# EAGLE schematic Schaltplan (EAGLE 9.6.2)
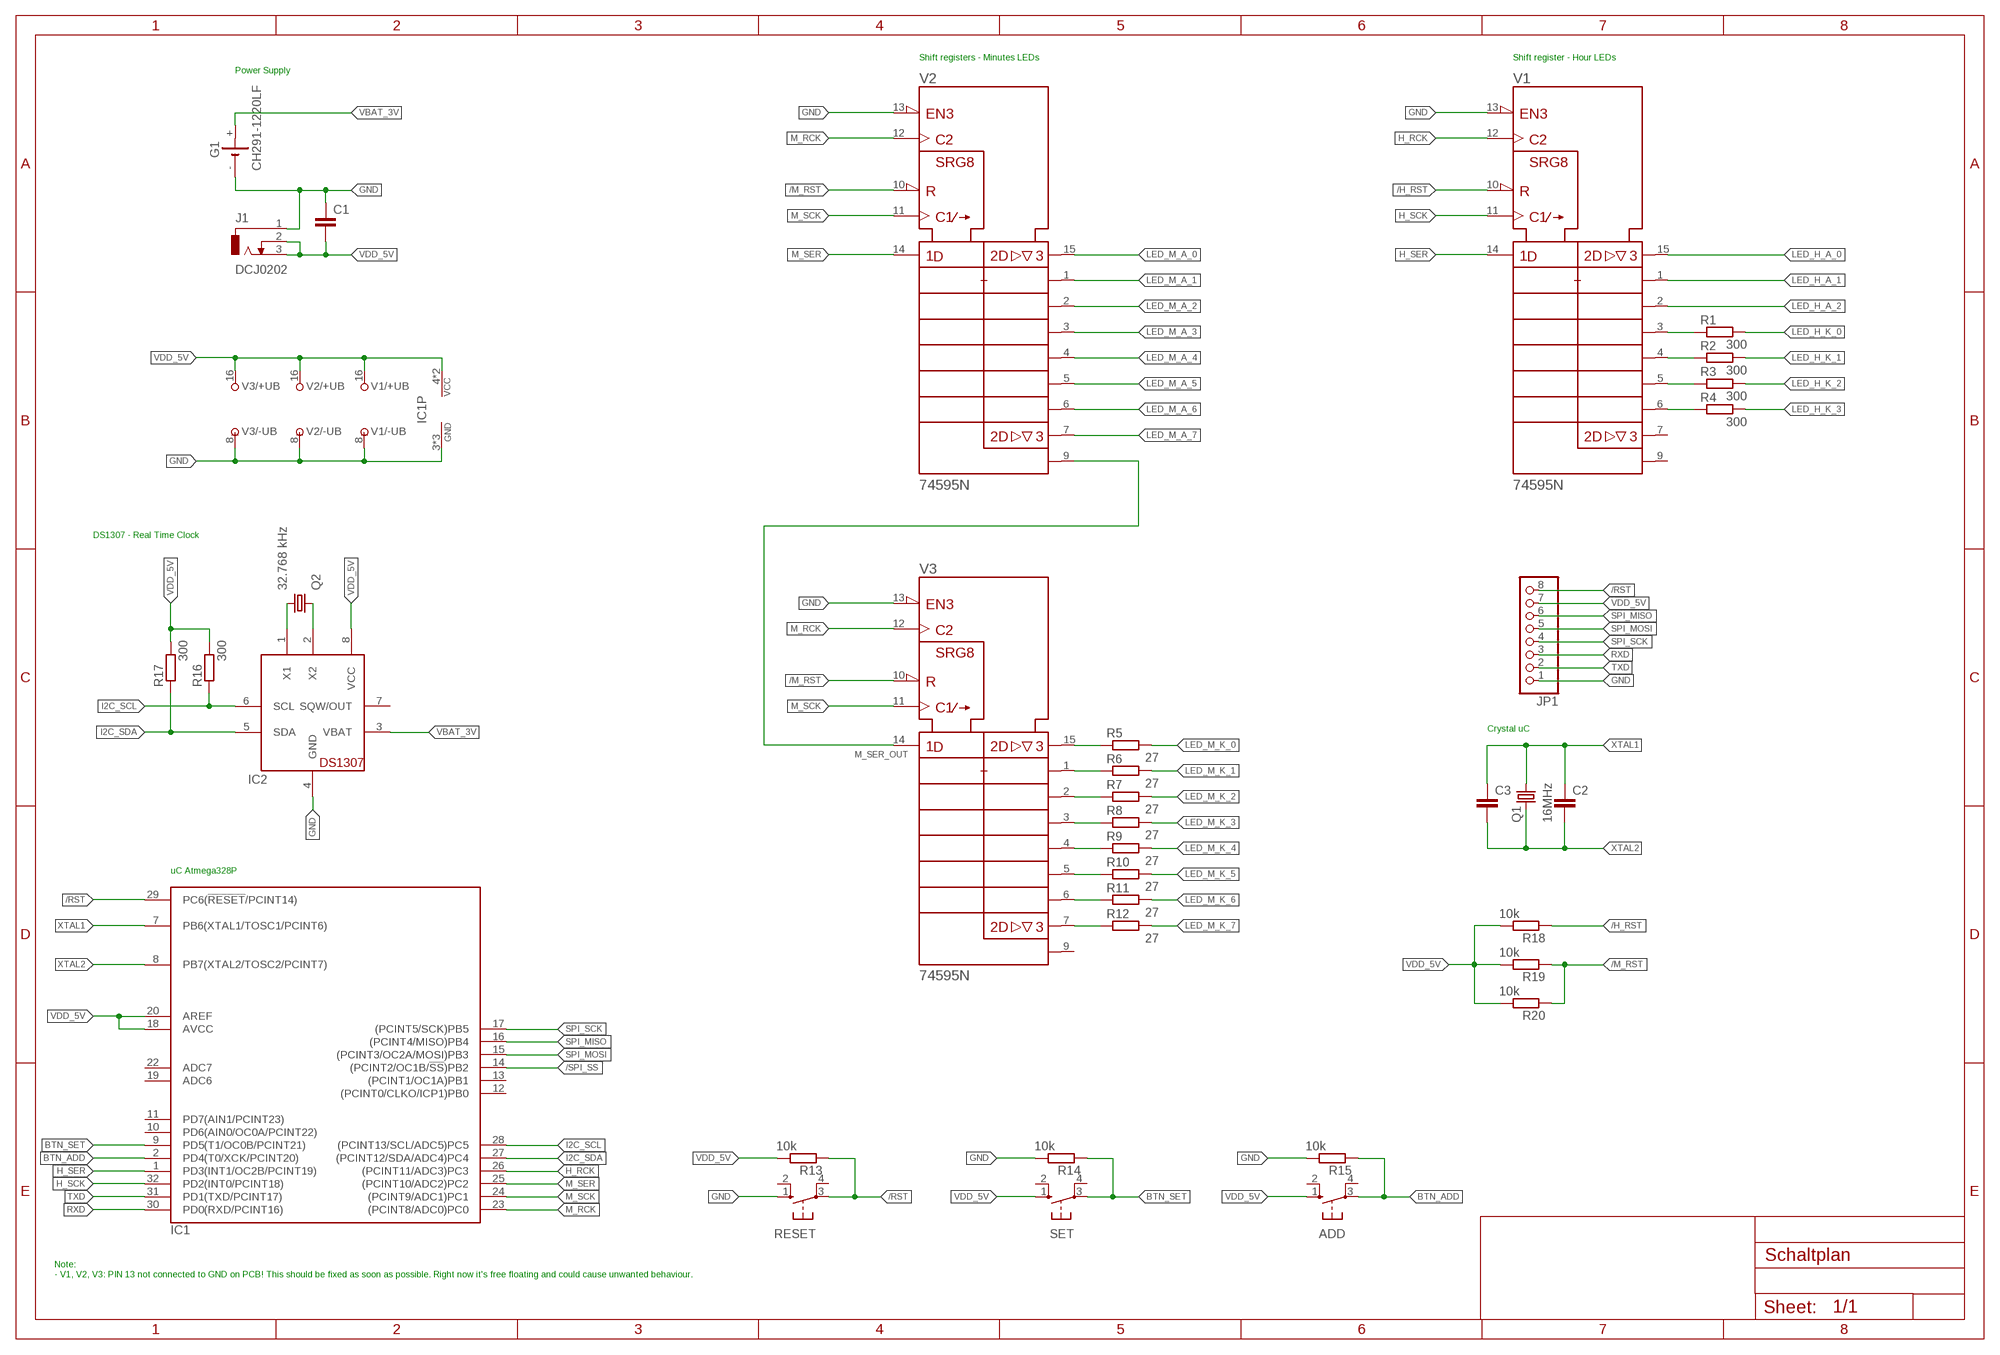
[diagram p0: schematic, sheet 1, part 1 of 2]
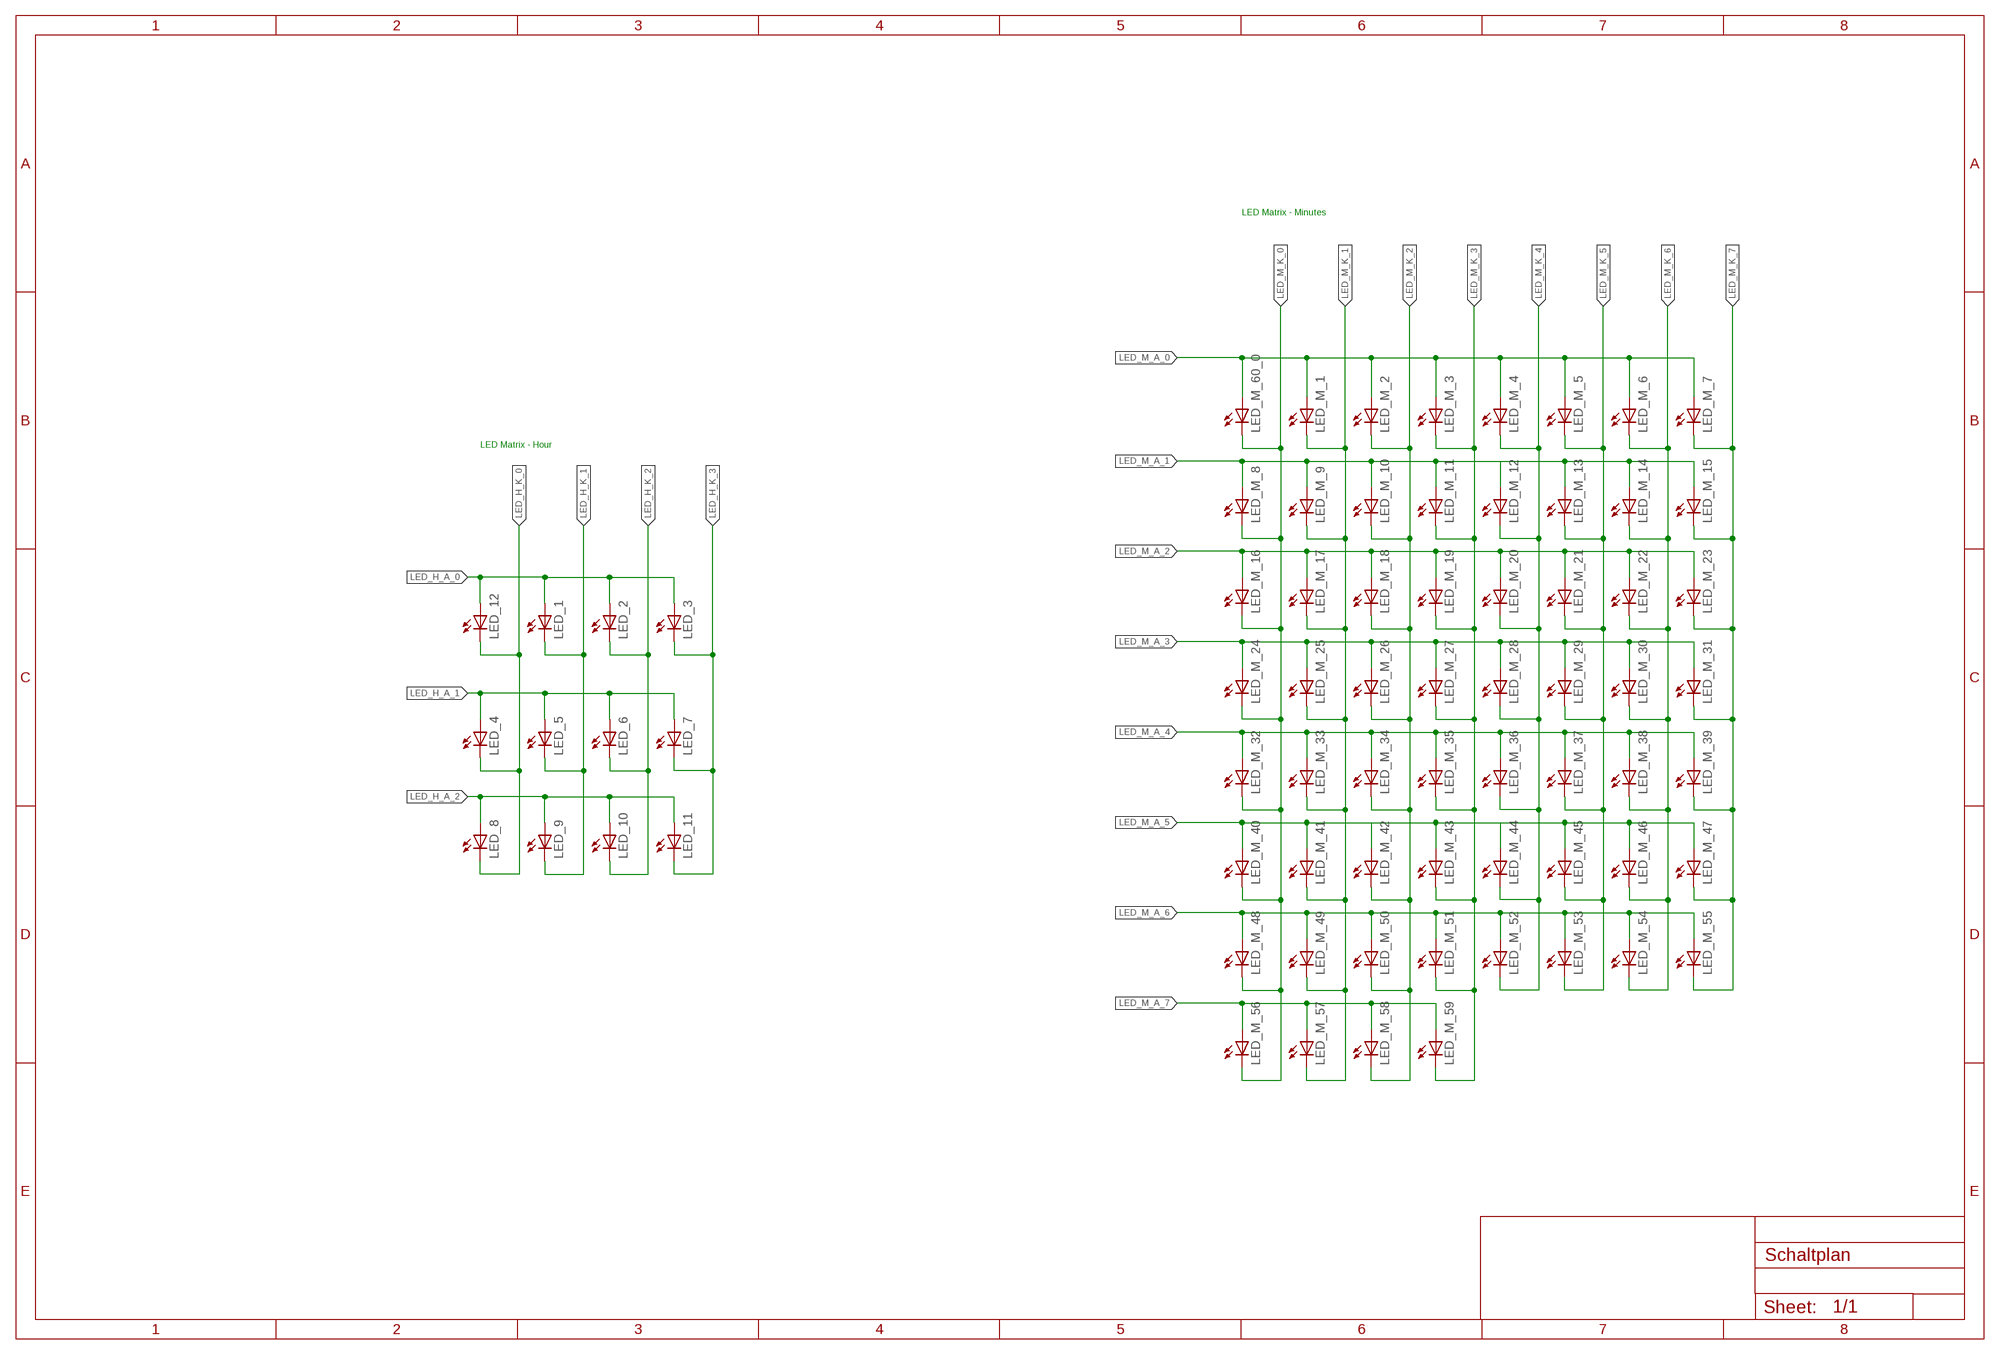
[diagram p1: schematic, sheet 1, part 2 of 2]

## Parts
ADD  10-XX  [B3F-10XX]
C1  C-EUC1206  [C1206]
C2  C-EUC1206  [C1206]
C3  C-EUC1206  [C1206]
G1  CH291-1220LF  [CH291-1220LF]
IC1  ATMEGA328P-AN  [QFP32_7X7_0.80]
IC2  DS1307  [DIL08]
J1  DCJ0202  [DCJ0202]
JP1  PINHD-1X8  [1X08]
LED_1  LED5MM  [LED5MM]
LED_2  LED5MM  [LED5MM]
LED_3  LED5MM  [LED5MM]
LED_4  LED5MM  [LED5MM]
LED_5  LED5MM  [LED5MM]
LED_6  LED5MM  [LED5MM]
LED_7  LED5MM  [LED5MM]
LED_8  LED5MM  [LED5MM]
LED_9  LED5MM  [LED5MM]
LED_10  LED5MM  [LED5MM]
LED_11  LED5MM  [LED5MM]
LED_12  LED5MM  [LED5MM]
LED_M_1  LED5MM  [LED5MM]
LED_M_2  LED5MM  [LED5MM]
LED_M_3  LED5MM  [LED5MM]
LED_M_4  LED5MM  [LED5MM]
LED_M_5  LED5MM  [LED5MM]
LED_M_6  LED5MM  [LED5MM]
LED_M_7  LED5MM  [LED5MM]
LED_M_8  LED5MM  [LED5MM]
LED_M_9  LED5MM  [LED5MM]
LED_M_10  LED5MM  [LED5MM]
LED_M_11  LED5MM  [LED5MM]
LED_M_12  LED5MM  [LED5MM]
LED_M_13  LED5MM  [LED5MM]
LED_M_14  LED5MM  [LED5MM]
LED_M_15  LED5MM  [LED5MM]
LED_M_16  LED5MM  [LED5MM]
LED_M_17  LED5MM  [LED5MM]
LED_M_18  LED5MM  [LED5MM]
LED_M_19  LED5MM  [LED5MM]
LED_M_20  LED5MM  [LED5MM]
LED_M_21  LED5MM  [LED5MM]
LED_M_22  LED5MM  [LED5MM]
LED_M_23  LED5MM  [LED5MM]
LED_M_24  LED5MM  [LED5MM]
LED_M_25  LED5MM  [LED5MM]
LED_M_26  LED5MM  [LED5MM]
LED_M_27  LED5MM  [LED5MM]
LED_M_28  LED5MM  [LED5MM]
LED_M_29  LED5MM  [LED5MM]
LED_M_30  LED5MM  [LED5MM]
LED_M_31  LED5MM  [LED5MM]
LED_M_32  LED5MM  [LED5MM]
LED_M_33  LED5MM  [LED5MM]
LED_M_34  LED5MM  [LED5MM]
LED_M_35  LED5MM  [LED5MM]
LED_M_36  LED5MM  [LED5MM]
LED_M_37  LED5MM  [LED5MM]
LED_M_38  LED5MM  [LED5MM]
LED_M_39  LED5MM  [LED5MM]
LED_M_40  LED5MM  [LED5MM]
LED_M_41  LED5MM  [LED5MM]
LED_M_42  LED5MM  [LED5MM]
LED_M_43  LED5MM  [LED5MM]
LED_M_44  LED5MM  [LED5MM]
LED_M_45  LED5MM  [LED5MM]
LED_M_46  LED5MM  [LED5MM]
LED_M_47  LED5MM  [LED5MM]
LED_M_48  LED5MM  [LED5MM]
LED_M_49  LED5MM  [LED5MM]
LED_M_50  LED5MM  [LED5MM]
LED_M_51  LED5MM  [LED5MM]
LED_M_52  LED5MM  [LED5MM]
LED_M_53  LED5MM  [LED5MM]
LED_M_54  LED5MM  [LED5MM]
LED_M_55  LED5MM  [LED5MM]
LED_M_56  LED5MM  [LED5MM]
LED_M_57  LED5MM  [LED5MM]
LED_M_58  LED5MM  [LED5MM]
LED_M_59  LED5MM  [LED5MM]
LED_M_60_0  LED5MM  [LED5MM]
Q1  16MHz  CRYSTALHC49UP  [HC49UP]
Q2  32.768 kHz  CRYSTALTC26V  [TC26V]
R1  300  R-EU_R5025  [R5025]
R2  300  R-EU_R5025  [R5025]
R3  300  R-EU_R5025  [R5025]
R4  300  R-EU_R5025  [R5025]
R5  27  R-EU_R5025  [R5025]
R6  27  R-EU_R5025  [R5025]
R7  27  R-EU_R5025  [R5025]
R8  27  R-EU_R5025  [R5025]
R9  27  R-EU_R5025  [R5025]
R10  27  R-EU_R5025  [R5025]
R11  27  R-EU_R5025  [R5025]
R12  27  R-EU_R5025  [R5025]
R13  10k  R-EU_R5025  [R5025]
R14  10k  R-EU_R5025  [R5025]
R15  10k  R-EU_R5025  [R5025]
R16  300  R-EU_R5025  [R5025]
R17  300  R-EU_R5025  [R5025]
R18  10k  R-EU_R5025  [R5025]
R19  10k  R-EU_R5025  [R5025]
R20  10k  R-EU_R5025  [R5025]
RESET  10-XX  [B3F-10XX]
SET  10-XX  [B3F-10XX]
V1  74595N  [DIL16]
V2  74595N  [DIL16]
V3  74595N  [DIL16]

## Nets
/H_RST: R18.1 V1.10(!SRCLR)
/M_RST: R19.1 R20.1 V2.10(!SRCLR) V3.10(!SRCLR)
/RST: IC1.29(PC6(!RESET!/PCINT14)) JP1.8 R13.1 RESET.3(P)
/SPI_SS: IC1.14((PCINT2/OC1B/!SS!)PB2)
BTN_ADD: ADD.3(P) IC1.2(PD4(T0/XCK/PCINT20)) R15.1
BTN_SET: IC1.9(PD5(T1/OC0B/PCINT21)) R14.1 SET.3(P)
GND: C1.1 G1.- IC1.3(GND) IC1.5(GND) IC1.21(GND) IC2.4(GND) J1.1 JP1.1 R14.2 R15.2 RESET.1(S) V1.8(-UB) V1.13(!G) V2.8(-UB) V2.13(!G) V3.8(-UB) V3.13(!G)
H_RCK: IC1.26((PCINT11/ADC3)PC3) V1.12(RCK)
H_SCK: IC1.32(PD2(INT0/PCINT18)) V1.11(SRCK)
H_SER: IC1.1(PD3(INT1/OC2B/PCINT19)) V1.14(SER)
I2C_SCL: IC1.28((PCINT13/SCL/ADC5)PC5) IC2.6(SCL) R16.1
I2C_SDA: IC1.27((PCINT12/SDA/ADC4)PC4) IC2.5(SDA) R17.1
LED_H_A_0: LED_1.A LED_2.A LED_3.A LED_12.A V1.15(QA)
LED_H_A_1: LED_4.A LED_5.A LED_6.A LED_7.A V1.1(QB)
LED_H_A_2: LED_8.A LED_9.A LED_10.A LED_11.A V1.2(QC)
LED_H_K_0: LED_4.K(C) LED_8.K(C) LED_12.K(C) R1.2
LED_H_K_1: LED_1.K(C) LED_5.K(C) LED_9.K(C) R2.2
LED_H_K_2: LED_2.K(C) LED_6.K(C) LED_10.K(C) R3.2
LED_H_K_3: LED_3.K(C) LED_7.K(C) LED_11.K(C) R4.2
LED_M_A_0: LED_M_1.A LED_M_2.A LED_M_3.A LED_M_4.A LED_M_5.A LED_M_6.A LED_M_7.A LED_M_60_0.A V2.15(QA)
LED_M_A_1: LED_M_8.A LED_M_9.A LED_M_10.A LED_M_11.A LED_M_12.A LED_M_13.A LED_M_14.A LED_M_15.A V2.1(QB)
LED_M_A_2: LED_M_16.A LED_M_17.A LED_M_18.A LED_M_19.A LED_M_20.A LED_M_21.A LED_M_22.A LED_M_23.A V2.2(QC)
LED_M_A_3: LED_M_24.A LED_M_25.A LED_M_26.A LED_M_27.A LED_M_28.A LED_M_29.A LED_M_30.A LED_M_31.A V2.3(QD)
LED_M_A_4: LED_M_32.A LED_M_33.A LED_M_34.A LED_M_35.A LED_M_36.A LED_M_37.A LED_M_38.A LED_M_39.A V2.4(QE)
LED_M_A_5: LED_M_40.A LED_M_41.A LED_M_42.A LED_M_43.A LED_M_44.A LED_M_45.A LED_M_46.A LED_M_47.A V2.5(QF)
LED_M_A_6: LED_M_48.A LED_M_49.A LED_M_50.A LED_M_51.A LED_M_52.A LED_M_53.A LED_M_54.A LED_M_55.A V2.6(QG)
LED_M_A_7: LED_M_56.A LED_M_57.A LED_M_58.A LED_M_59.A V2.7(QH)
LED_M_K_0: LED_M_8.K(C) LED_M_16.K(C) LED_M_24.K(C) LED_M_32.K(C) LED_M_40.K(C) LED_M_48.K(C) LED_M_56.K(C) LED_M_60_0.K(C) R5.2
LED_M_K_1: LED_M_1.K(C) LED_M_9.K(C) LED_M_17.K(C) LED_M_25.K(C) LED_M_33.K(C) LED_M_41.K(C) LED_M_49.K(C) LED_M_57.K(C) R6.2
LED_M_K_2: LED_M_2.K(C) LED_M_10.K(C) LED_M_18.K(C) LED_M_26.K(C) LED_M_34.K(C) LED_M_42.K(C) LED_M_50.K(C) LED_M_58.K(C) R7.2
LED_M_K_3: LED_M_3.K(C) LED_M_11.K(C) LED_M_19.K(C) LED_M_27.K(C) LED_M_35.K(C) LED_M_43.K(C) LED_M_51.K(C) LED_M_59.K(C) R8.2
LED_M_K_4: LED_M_4.K(C) LED_M_12.K(C) LED_M_20.K(C) LED_M_28.K(C) LED_M_36.K(C) LED_M_44.K(C) LED_M_52.K(C) R9.2
LED_M_K_5: LED_M_5.K(C) LED_M_13.K(C) LED_M_21.K(C) LED_M_29.K(C) LED_M_37.K(C) LED_M_45.K(C) LED_M_53.K(C) R10.2
LED_M_K_6: LED_M_6.K(C) LED_M_14.K(C) LED_M_22.K(C) LED_M_30.K(C) LED_M_38.K(C) LED_M_46.K(C) LED_M_54.K(C) R11.2
LED_M_K_7: LED_M_7.K(C) LED_M_15.K(C) LED_M_23.K(C) LED_M_31.K(C) LED_M_39.K(C) LED_M_47.K(C) LED_M_55.K(C) R12.2
M_RCK: IC1.23((PCINT8/ADC0)PC0) V2.12(RCK) V3.12(RCK)
M_SCK: IC1.24((PCINT9/ADC1)PC1) V2.11(SRCK) V3.11(SRCK)
M_SER: IC1.25((PCINT10/ADC2)PC2) V2.14(SER)
M_SER_OUT: V2.9(QH*) V3.14(SER)
N$1: R5.1 V3.15(QA)
N$5: R6.1 V3.1(QB)
N$6: R1.1 V1.3(QD)
N$7: R7.1 V3.2(QC)
N$8: R8.1 V3.3(QD)
N$9: R9.1 V3.4(QE)
N$10: R10.1 V3.5(QF)
N$11: R11.1 V3.6(QG)
N$12: R12.1 V3.7(QH)
N$14: R2.1 V1.4(QE)
N$15: R3.1 V1.5(QF)
N$16: R4.1 V1.6(QG)
N$47: IC2.1(X1) Q2.1
N$48: IC2.2(X2) Q2.2
RXD: IC1.30(PD0(RXD/PCINT16)) JP1.3
SPI_MISO: IC1.16((PCINT4/MISO)PB4) JP1.6
SPI_MOSI: IC1.15((PCINT3/OC2A/MOSI)PB3) JP1.5
SPI_SCK: IC1.17((PCINT5/SCK)PB5) JP1.4
TXD: IC1.31(PD1(TXD/PCINT17)) JP1.2
VBAT_3V: G1.+ IC2.3(VBAT)
VDD_5V: ADD.1(S) C1.2 IC1.4(VCC) IC1.6(VCC) IC1.18(AVCC) IC1.20(AREF) IC2.8(VCC) J1.2 J1.3 JP1.7 R13.2 R16.2 R17.2 R18.2 R19.2 R20.2 SET.1(S) V1.16(+UB) V2.16(+UB) V3.16(+UB)
XTAL1: C2.1 C3.1 IC1.7(PB6(XTAL1/TOSC1/PCINT6)) Q1.2
XTAL2: C2.2 C3.2 IC1.8(PB7(XTAL2/TOSC2/PCINT7)) Q1.1
Unconnected: ADD.2(S1) ADD.4(P1) IC1.10(PD6(AIN0/OC0A/PCINT22)) IC1.11(PD7(AIN1/PCINT23)) IC1.12((PCINT0/CLKO/ICP1)PB0) IC1.13((PCINT1/OC1A)PB1) IC1.19(ADC6) IC1.22(ADC7) IC2.7(SQW/OUT) RESET.2(S1) RESET.4(P1) SET.2(S1) SET.4(P1) V1.7(QH) V1.9(QH*) V3.9(QH*)

## Notes on the sheet
- Shift registers - Minutes LEDs | Shift register - Hour LEDs
- Power Supply
- DS1307 - Real Time Clock
- Crystal uC
- uC Atmega328P
- Note:
  - V1, V2, V3: PIN 13 not connected to GND on PCB! This should be fixed as soon as possible. Right now it's free floating and could cause unwanted behaviour.
- LED Matrix - Minutes
- LED Matrix - Hour

## Library data of the parts
ADD RESET SET = switch-omron:10-XX: OMRON SWITCH; MPN: B3F-1000; OC_FARNELL: 176432; OC_NEWARK: 36M3542
C1-C3 = rcl:C-EU: CAPACITOR, European symbol; SPICEPREFIX: C
G1 = battery:CH291-1220LF: Battery Holder, SMT, 12mm multicomp PART NO. CH291-1220LF Source: Data sheet <http://www.farnell.com/datasheets/1505860.pdf>
IC1 = atmel:ATMEGA*8: 8-bit AVR Microcontroller 4/8/16/32 kbytes flash 512/1k/1k/2k bytes SRAM 256/512/512/1k bytes EEPROM USART, 6/8-channel 10 bit ADC Pin compatible with Atmega8(L,A) Note: ADC6 and ADC7 are not available in 28-lead packages
IC2 = adafruit:DS1307: DS1307 Real time clock (RTC) with battery backup ability. Talk to it via i2c
J1 = con-jack:DCJ0202: DC POWER JACK Source: DCJ0202.pdf; OC_FARNELL: unknown; OC_NEWARK: unknown
JP1 = pinhead:PINHD-1X8: PIN HEADER
LED_1-LED_12 LED_M_1-LED_M_59 LED_M_60_0 = adafruit:LED: LED OSRAM: - CHIPLED LG R971, LG N971, LY N971, LG Q971, LY Q971, LO R971, LY R971 LH N974, LH R974 LS Q976, LO Q976, LY Q976 LO Q996 - Hyper CHIPLED LW Q18S LB Q993, LB Q99A, LB R99A - SideLED LS A670, LO A670, LY A670, LG A670, LP A670 LB A673, LV A673, LT A673, LW A673 LH A674 LY A675 LS A676, LA A676, LO A676, LY A676, LW A676 LS A679, LY A679, LG A679 - Hyper Micro SIDELED® LS Y876, LA Y876, LO Y876, LY Y876 LT Y87S - SmartLED LW L88C, LW L88S LB L89C, LB L89S, LG L890 LS L89K, LO L89K, LY L89K LS L896, LA L896, LO L896, LY L896 - TOPLED LS T670, LO T670, LY T670, LG T670, LP T670 LSG T670, LSP T670, LSY T670, LOP T670, LYG T670 LG T671, LOG T671, LSG T671 LB T673, LV T673, LT T673, LW T673 LH T674 LS T676, LA T676, LO T676, LY T676, LB T676, LH T676, LSB T676, LW T676 LB T67C, LV T67C, LT T67C, LS T67K, LO T67K, LY T67K, LW E67C LS E67B, LA E67B, LO E67B, LY E67B, LB E67C, LV E67C, LT E67C LW T67C LS T679, LY T679, LG T679 LS T770, LO T770, LY T770, LG T770, LP T770 LB T773, LV T773, LT T773, LW T773 LH T774 LS E675, LA E675, LY E675, LS T675 LS T776, LA T776, LO T776, LY T776, LB T776 LHGB T686 LT T68C, LB T68C - Hyper Mini TOPLED® LB M676 - Mini TOPLED Santana® LG M470 LS M47K, LO M47K, LY M47K Source: http://www.osram.convergy.de/
Q1 = adafruit:CRYSTAL: CRYSTAL; OC_FARNELL: unknown; OC_NEWARK: unknown
Q2 = crystal:CRYSTAL: CRYSTAL; OC_FARNELL: unknown; OC_NEWARK: unknown
R1-R20 = rcl:R-EU_: RESISTOR, European symbol; SPICEPREFIX: R
V1-V3 = 74ttl-din:74*595: 8-bit SHIFT REGISTER, output latch